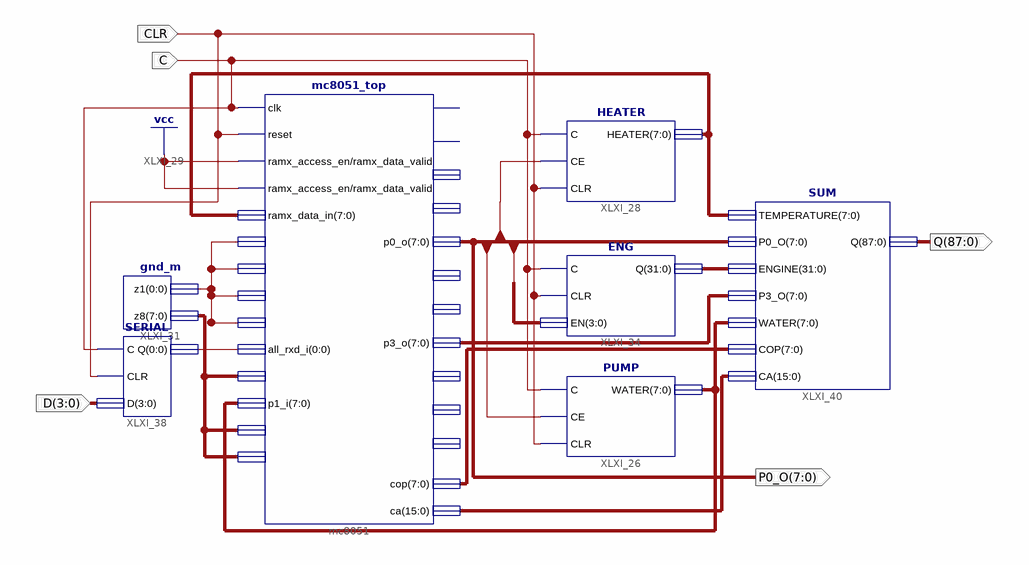
[diagram p0: schematic sheet 1]
// Xilinx ISE schematic top_mps.sch (spartan6) as structural Verilog: 7 symbols, 5 ports
module top_mps (
  input  C,
  input  CLR,
  input  [3:0] D,
  output [7:0] P0_O,
  output [87:0] Q
);

  wire [0:0] XLXN_276, XLXN_310;
  wire [7:0] COP, P3_O, TEMPERATURE, XLXN_269, XLXN_323;
  wire [15:0] CA;
  wire [31:0] XLXN_327;

  mc8051_top mc8051 (
    .clk(C), .reset(CLR), .ramx_access_en(1'b1), .ramx_data_valid(1'b1), .ramx_data_in(TEMPERATURE),
    .int0_i(XLXN_276[0]), .int1_i(XLXN_276[0]), .all_t0_i(XLXN_276[0]), .all_t1_i(XLXN_276[0]),
    .all_rxd_i(XLXN_310[0]), .p0_i(XLXN_269), .p1_i(XLXN_323), .p2_i(XLXN_269), .p3_i(XLXN_269), .p0_o(P0_O),
    .p3_o(P3_O), .cop(COP), .ca(CA));  // open: ramx_wr, ramx_rd, ramx_data_out, ramx_adr, p1_o, p2_o, all_rxd_o, all_txd_o, all_rxdwr_o
  PUMP XLXI_26 (.C(C), .CE(P0_O[1]), .CLR(CLR), .WATER(XLXN_323));
  HEATER XLXI_28 (.C(C), .CE(P0_O[2]), .CLR(CLR), .HEATER(TEMPERATURE));
  gnd_m XLXI_31 (.z1(XLXN_276[0]), .z8(XLXN_269));
  ENG XLXI_34 (.C(C), .CLR(CLR), .EN(P0_O[7:4]), .Q(XLXN_327));
  SERIAL XLXI_38 (.C(C), .CLR(CLR), .D(D), .Q(XLXN_310[0]));
  SUM XLXI_40 (
    .COP(COP), .CA(CA), .TEMPERATURE(TEMPERATURE), .Q(Q), .P3_O(P3_O), .P0_O(P0_O), .ENGINE(XLXN_327),
    .WATER(XLXN_323));
endmodule
